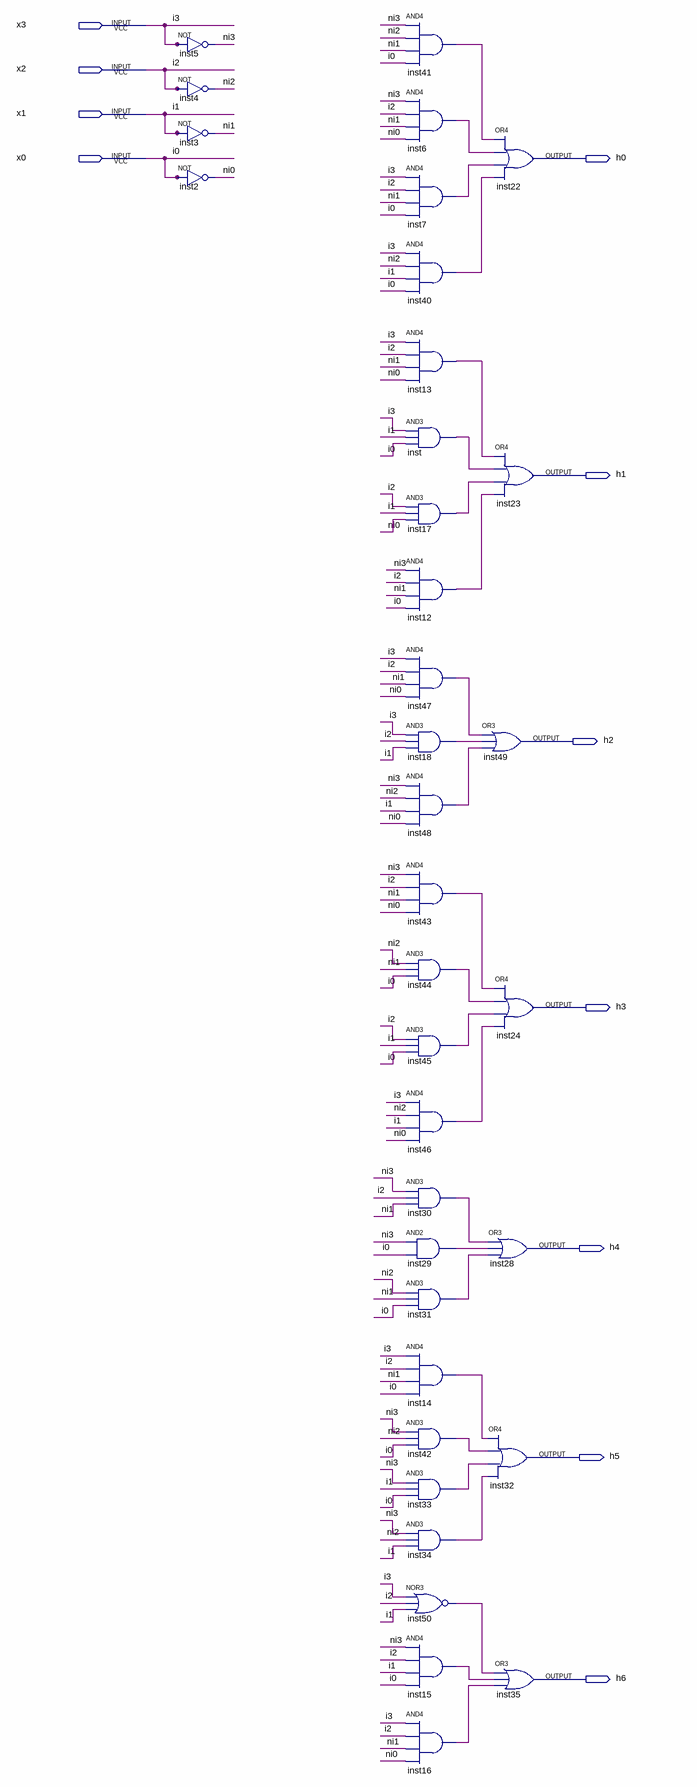
[diagram p0: schematic sheet]
// Quartus schematic HexDisplay.bdf as structural Verilog: 36 symbols, 11 pins
module HexDisplay (
  input  x3,
  input  x2,
  input  x1,
  input  x0,
  output h0,
  output h1,
  output h2,
  output h3,
  output h4,
  output h5,
  output h6
);

  wire inst6_out, inst7_out, inst12_out, inst13_out, inst14_out, inst15_out, inst16_out, inst17_out,
       inst18_out, inst29_out, inst30_out, inst31_out, inst33_out, inst34_out, inst40_out, inst41_out,
       inst42_out, inst43_out, inst44_out, inst45_out, inst46_out, inst47_out, inst48_out, inst50_out,
       inst_out, ni0, ni1, ni2, ni3;

  not inst5 (ni3, x3);
  not inst4 (ni2, x2);
  not inst3 (ni1, x1);
  not inst2 (ni0, x0);
  and inst41 (inst41_out, ni3, ni2, ni1, x0);
  and inst6 (inst6_out, ni3, x2, ni1, ni0);
  and inst7 (inst7_out, x3, x2, ni1, x0);
  and inst40 (inst40_out, x3, ni2, x1, x0);
  and inst13 (inst13_out, x3, x2, ni1, ni0);
  and inst (inst_out, x3, x1, x0);
  and inst17 (inst17_out, x2, x1, ni0);
  and inst12 (inst12_out, ni3, x2, ni1, x0);
  and inst47 (inst47_out, x3, x2, ni1, ni0);
  and inst18 (inst18_out, x3, x2, x1);
  and inst48 (inst48_out, ni3, ni2, x1, ni0);
  and inst43 (inst43_out, ni3, x2, ni1, ni0);
  and inst44 (inst44_out, ni2, ni1, x0);
  and inst45 (inst45_out, x2, x1, x0);
  and inst46 (inst46_out, x3, ni2, x1, ni0);
  and inst30 (inst30_out, ni3, x2, ni1);
  and inst29 (inst29_out, ni3, x0);
  and inst31 (inst31_out, ni2, ni1, x0);
  and inst14 (inst14_out, x3, x2, ni1, x0);
  and inst42 (inst42_out, ni3, ni2, x0);
  and inst33 (inst33_out, ni3, x1, x0);
  and inst34 (inst34_out, ni3, ni2, x1);
  nor inst50 (inst50_out, x3, x2, x1);
  and inst15 (inst15_out, ni3, x2, x1, x0);
  and inst16 (inst16_out, x3, x2, ni1, ni0);
  or inst22 (h0, inst41_out, inst6_out, inst7_out, inst40_out);
  or inst23 (h1, inst13_out, inst_out, inst17_out, inst12_out);
  or inst49 (h2, inst47_out, inst18_out, inst48_out);
  or inst24 (h3, inst43_out, inst44_out, inst45_out, inst46_out);
  or inst28 (h4, inst30_out, inst29_out, inst31_out);
  or inst32 (h5, inst14_out, inst42_out, inst33_out, inst34_out);
  or inst35 (h6, inst50_out, inst15_out, inst16_out);

  // Other names for the same wires on the sheet: i0 = x0; i1 = x1; i2 = x2; i3 = x3
endmodule
